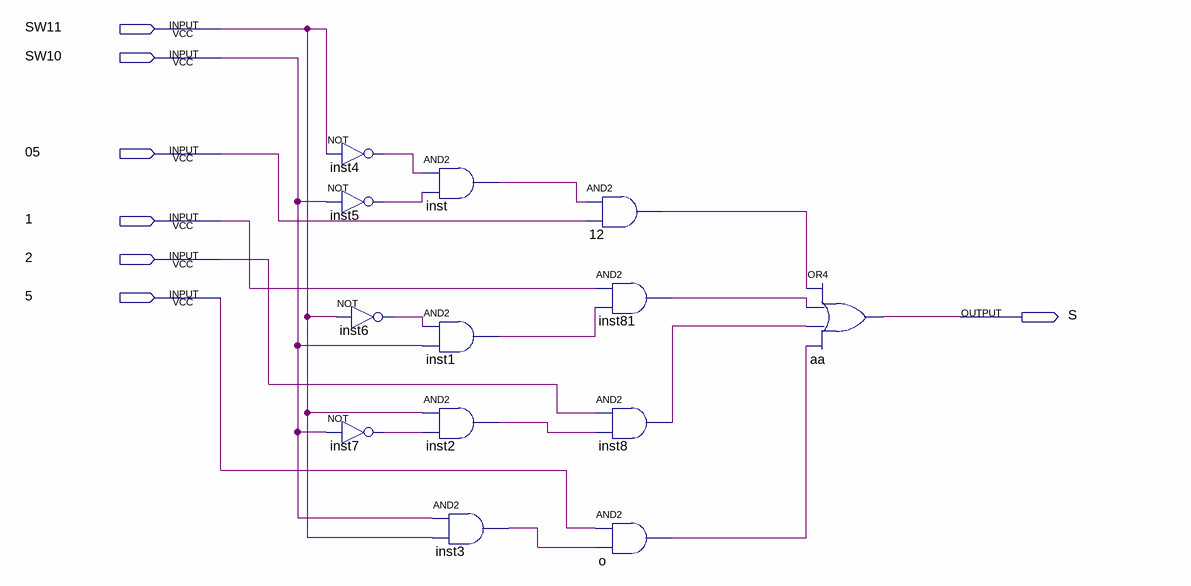
[diagram p0: schematic sheet]
// Quartus schematic MUX.bdf as structural Verilog: 13 symbols, 7 pins
module MUX (
  input  SW11,
  input  SW10,
  input  \05 ,
  input  \1 ,
  input  \2 ,
  input  \5 ,
  output S
);

  wire inst1_out, inst2_out, inst3_out, inst4_out, inst5_out, inst6_out, inst7_out, inst8_out, inst81_out,
       inst_out, n12_out, o_out;

  not inst4 (inst4_out, SW11);
  not inst5 (inst5_out, SW10);
  not inst6 (inst6_out, SW11);
  not inst7 (inst7_out, SW10);
  and inst (inst_out, inst4_out, inst5_out);
  and inst1 (inst1_out, inst6_out, SW10);
  and inst2 (inst2_out, SW11, inst7_out);
  and inst3 (inst3_out, SW10, SW11);
  and u_12 (n12_out, inst_out, \05 );
  and inst81 (inst81_out, \1 , inst1_out);
  and inst8 (inst8_out, \2 , inst2_out);
  and o (o_out, \5 , inst3_out);
  or aa (S, n12_out, inst81_out, inst8_out, o_out);
endmodule
